# EAGLE schematic robot (EAGLE 9.6.2)
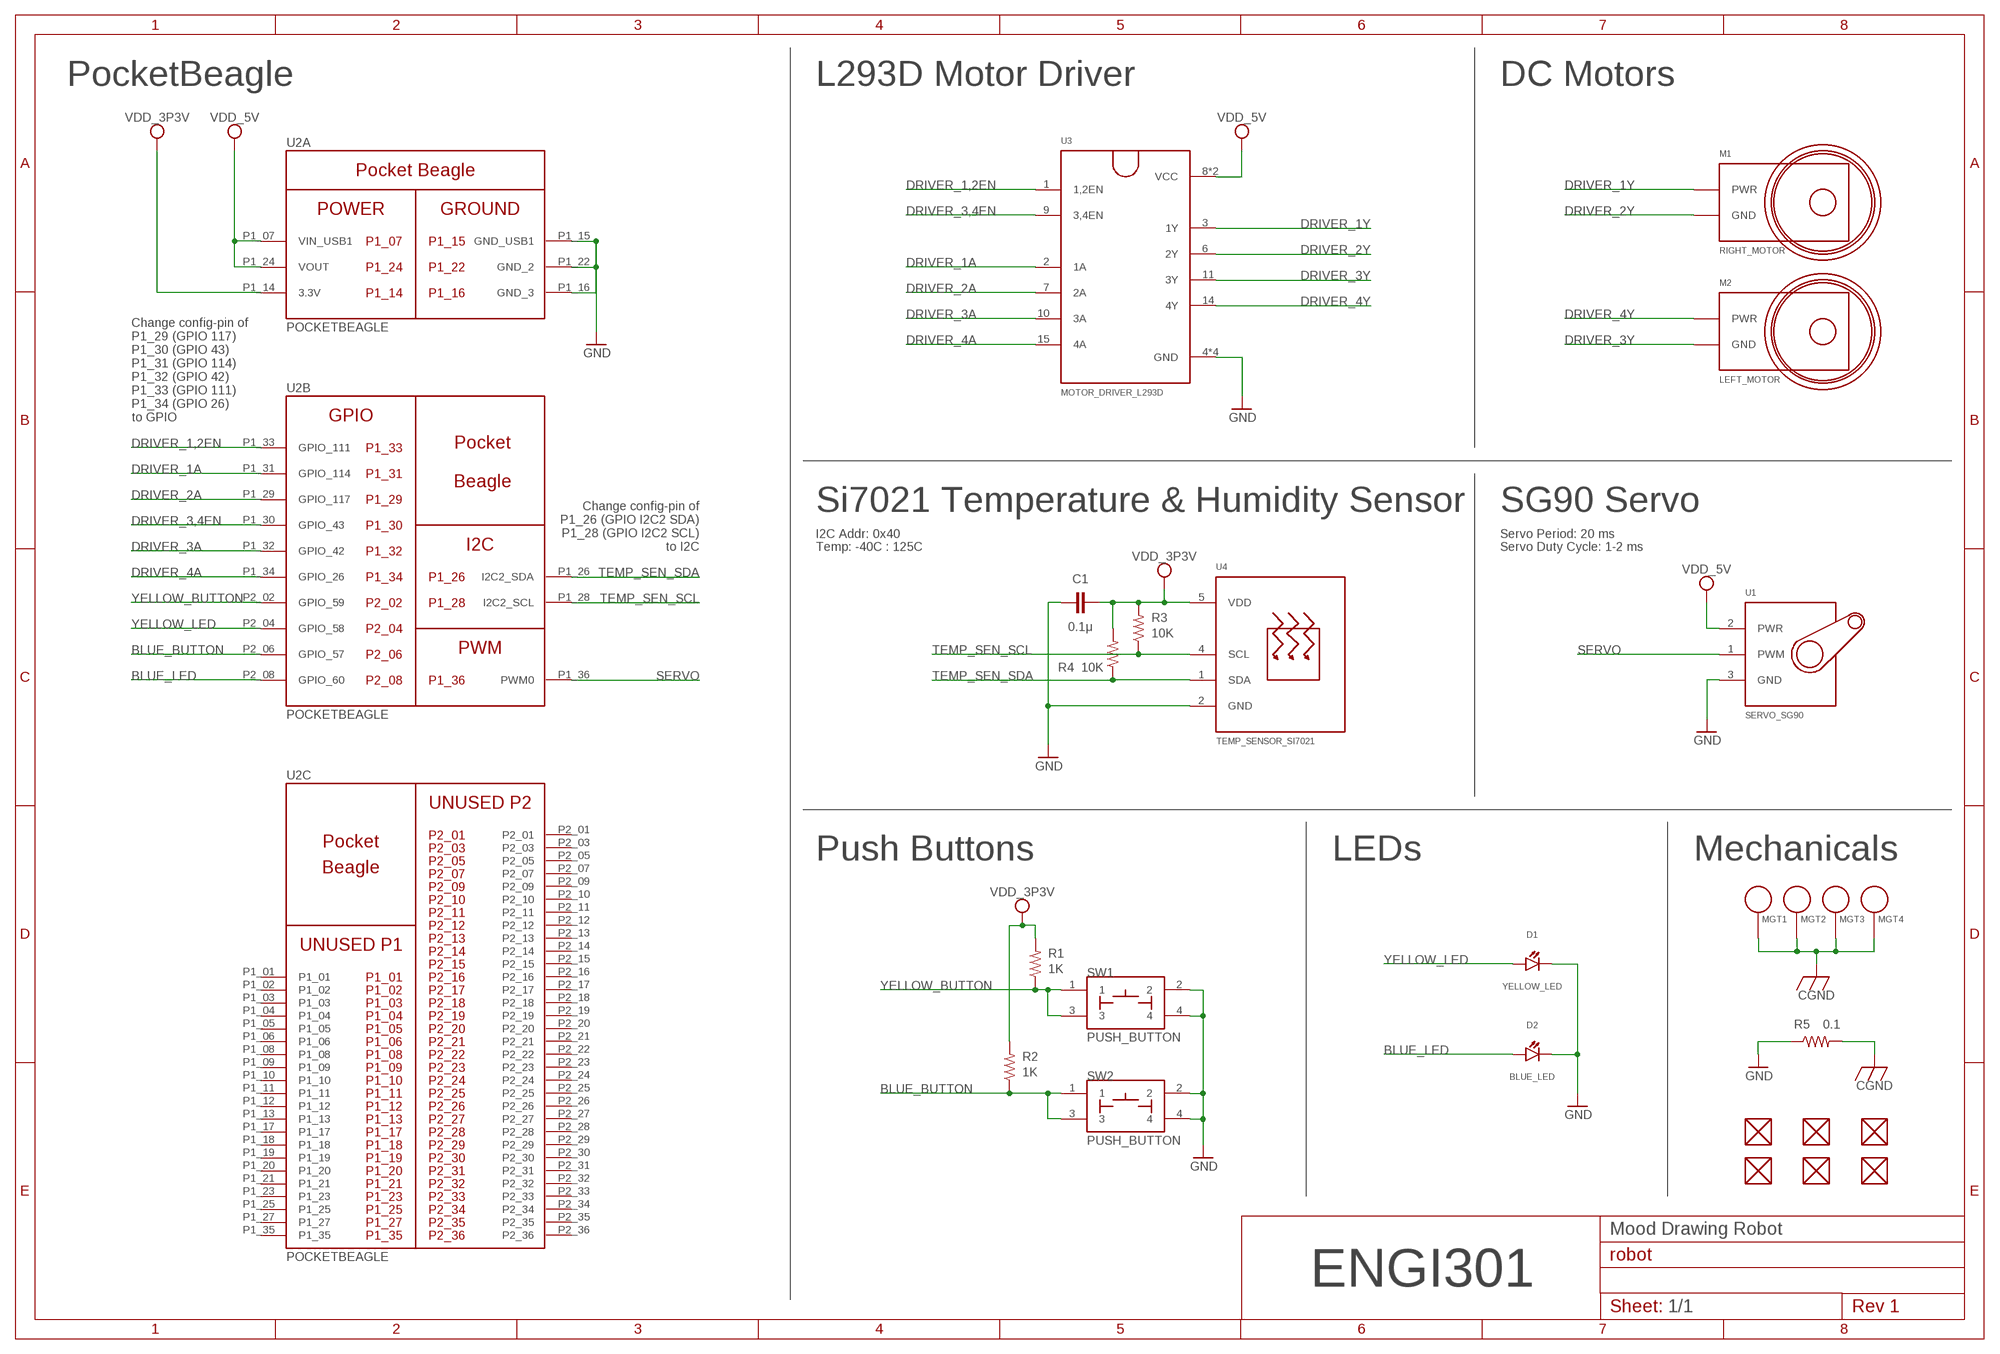
[diagram p0: schematic, sheet 1]

## Parts
C1  0.1μ  C_C0603  [C0603]
D1  YELLOW_LED  LED  [LED_EIA_STD]
D2  BLUE_LED  LED  [LED_EIA_STD]
FUD1  FIDUCIAL  [FIDUCIAL_40MIL]
FUD2  FIDUCIAL  [FIDUCIAL_40MIL]
FUD3  FIDUCIAL  [FIDUCIAL_40MIL]
FUD4  FIDUCIAL  [FIDUCIAL_40MIL]
FUD5  FIDUCIAL  [FIDUCIAL_40MIL]
FUD6  FIDUCIAL  [FIDUCIAL_40MIL]
M1  RIGHT_MOTOR  DC_MOTOR  [DC_MOTOR]
M2  LEFT_MOTOR  DC_MOTOR  [DC_MOTOR]
MGT1  MOUNTING_HOLE  [MOUNTING_HOLE]
MGT2  MOUNTING_HOLE  [MOUNTING_HOLE]
MGT3  MOUNTING_HOLE  [MOUNTING_HOLE]
MGT4  MOUNTING_HOLE  [MOUNTING_HOLE]
R1  1K  R_R0603  [R0603]
R2  1K  R_R0603  [R0603]
R3  10K  R_R0603  [R0603]
R4  10K  R_R0603  [R0603]
R5  0.1  R_R0805  [R0805]
SW1  PUSH_BUTTON  [PUSH_BUTTON_12.5MM]
SW2  PUSH_BUTTON  [PUSH_BUTTON_12.5MM]
U1  SERVO_SG90  [SERVO]
U2  POCKETBEAGLE  [POCKETBEAGLE]
U3  MOTOR_DRIVER_L293D  [MOTOR_DRIVER]
U4  TEMP_SENSOR_SI7021  [TEMP_SENSOR]

## Nets
BLUE_BUTTON: R2.1 SW2.1 SW2.3 U2.P2_06(B:GPIO_57)
BLUE_LED: D2.ANODE U2.P2_08(B:GPIO_60)
CGND: MGT1.P$1 MGT2.P$1 MGT3.P$1 MGT4.P$1 R5.2
DRIVER_1,2EN: U2.P1_33(B:GPIO_111) U3.1(1,2EN)
DRIVER_1A: U2.P1_31(B:GPIO_114) U3.2(1A)
DRIVER_1Y: M1.PWR U3.3(1Y)
DRIVER_2A: U2.P1_29(B:GPIO_117) U3.7(2A)
DRIVER_2Y: M1.GND U3.6(2Y)
DRIVER_3,4EN: U2.P1_30(B:GPIO_43) U3.9(3,4EN)
DRIVER_3A: U2.P1_32(B:GPIO_42) U3.10(3A)
DRIVER_3Y: M2.GND U3.11(3Y)
DRIVER_4A: U2.P1_34(B:GPIO_26) U3.15(4A)
DRIVER_4Y: M2.PWR U3.14(4Y)
GND: C1.1 D1.CATHODE D2.CATHODE R5.1 SW1.2 SW1.4 SW2.2 SW2.4 U1.3(GND) U2.P1_15(A:GND_USB1) U2.P1_16(A:GND_3) U2.P1_22(A:GND_2) U3.4(GND) U3.5(GND) U3.12(GND) U3.13(GND) U4.2(GND)
SERVO: U1.1(PWM) U2.P1_36(B:PWM0)
TEMP_SEN_SCL: R3.1 U2.P1_28(B:I2C2_SCL) U4.4(SCL)
TEMP_SEN_SDA: R4.1 U2.P1_26(B:I2C2_SDA) U4.1(SDA)
VDD_3P3V: C1.2 R1.2 R2.2 R3.2 R4.2 U2.P1_14(A:3.3V) U4.5(VDD)
VDD_5V: U1.2(PWR) U2.P1_07(A:VIN_USB1) U2.P1_24(A:VOUT) U3.8(VCC) U3.16(VCC)
YELLOW_BUTTON: R1.1 SW1.1 SW1.3 U2.P2_02(B:GPIO_59)
YELLOW_LED: D1.ANODE U2.P2_04(B:GPIO_58)
Unconnected: FUD1.P$1 FUD2.P$1 FUD3.P$1 FUD4.P$1 FUD5.P$1 FUD6.P$1 U2.P1_01(C:P1_01) U2.P1_02(C:P1_02) U2.P1_03(C:P1_03) U2.P1_04(C:P1_04) U2.P1_05(C:P1_05) U2.P1_06(C:P1_06) U2.P1_08(C:P1_08) U2.P1_09(C:P1_09) U2.P1_10(C:P1_10) U2.P1_11(C:P1_11) U2.P1_12(C:P1_12) U2.P1_13(C:P1_13) U2.P1_17(C:P1_17) U2.P1_18(C:P1_18) U2.P1_19(C:P1_19) U2.P1_20(C:P1_20) U2.P1_21(C:P1_21) U2.P1_23(C:P1_23) U2.P1_25(C:P1_25) U2.P1_27(C:P1_27) U2.P1_35(C:P1_35) U2.P2_01(C:P2_01) U2.P2_03(C:P2_03) U2.P2_05(C:P2_05) U2.P2_07(C:P2_07) U2.P2_09(C:P2_09) U2.P2_10(C:P2_10) U2.P2_11(C:P2_11) U2.P2_12(C:P2_12) U2.P2_13(C:P2_13) U2.P2_14(C:P2_14) U2.P2_15(C:P2_15) U2.P2_16(C:P2_16) U2.P2_17(C:P2_17) U2.P2_18(C:P2_18) U2.P2_19(C:P2_19) U2.P2_20(C:P2_20) U2.P2_21(C:P2_21) U2.P2_22(C:P2_22) U2.P2_23(C:P2_23) U2.P2_24(C:P2_24) U2.P2_25(C:P2_25) U2.P2_26(C:P2_26) U2.P2_27(C:P2_27) U2.P2_28(C:P2_28) U2.P2_29(C:P2_29) U2.P2_30(C:P2_30) U2.P2_31(C:P2_31) U2.P2_32(C:P2_32) U2.P2_33(C:P2_33) U2.P2_34(C:P2_34) U2.P2_35(C:P2_35) U2.P2_36(C:P2_36)

## Notes on the sheet
- PocketBeagle | L293D Motor Driver | DC Motors
- Change config-pin of
  P1_29 (GPIO 117)
  P1_30 (GPIO 43)
  P1_31 (GPIO 114)
  P1_32 (GPIO 42)
  P1_33 (GPIO 111)
  P1_34 (GPIO 26)
  to GPIO
- Si7021 Temperature & Humidity Sensor | SG90 Servo
- I2C Addr: 0x40 | Servo Period: 20 ms
- Change config-pin of
  P1_26 (GPIO I2C2 SDA)
  P1_28 (GPIO I2C2 SCL)
  to I2C
- Temp: -40C : 125C | Servo Duty Cycle: 1-2 ms
- Push Buttons | LEDs | Mechanicals
- Mood Drawing Robot
- ENGI301
- 1/1

## Library data of the parts
C1 = robot:C_: Capacitor SMD. Sizes: 0402, 0603 & 0805
D1 D2 = robot:LED: EIA-STD LED; LTST-C191TBKT
FUD1-FUD6 = robot:FIDUCIAL
M1 M2 = robot:DC_MOTOR
MGT1-MGT4 = robot:MOUNTING_HOLE: Chassis Mounting Hole w/GND connection ability
R1-R5 = robot:R_: RESISTOR, American symbol
SW1 SW2 = robot:PUSH_BUTTON
U1 = robot:SERVO_SG90
U2 = robot:POCKETBEAGLE
U3 = robot:MOTOR_DRIVER_L293D
U4 = robot:TEMP_SENSOR_SI7021